# EAGLE design inst_amp (EAGLE 6.5.0)
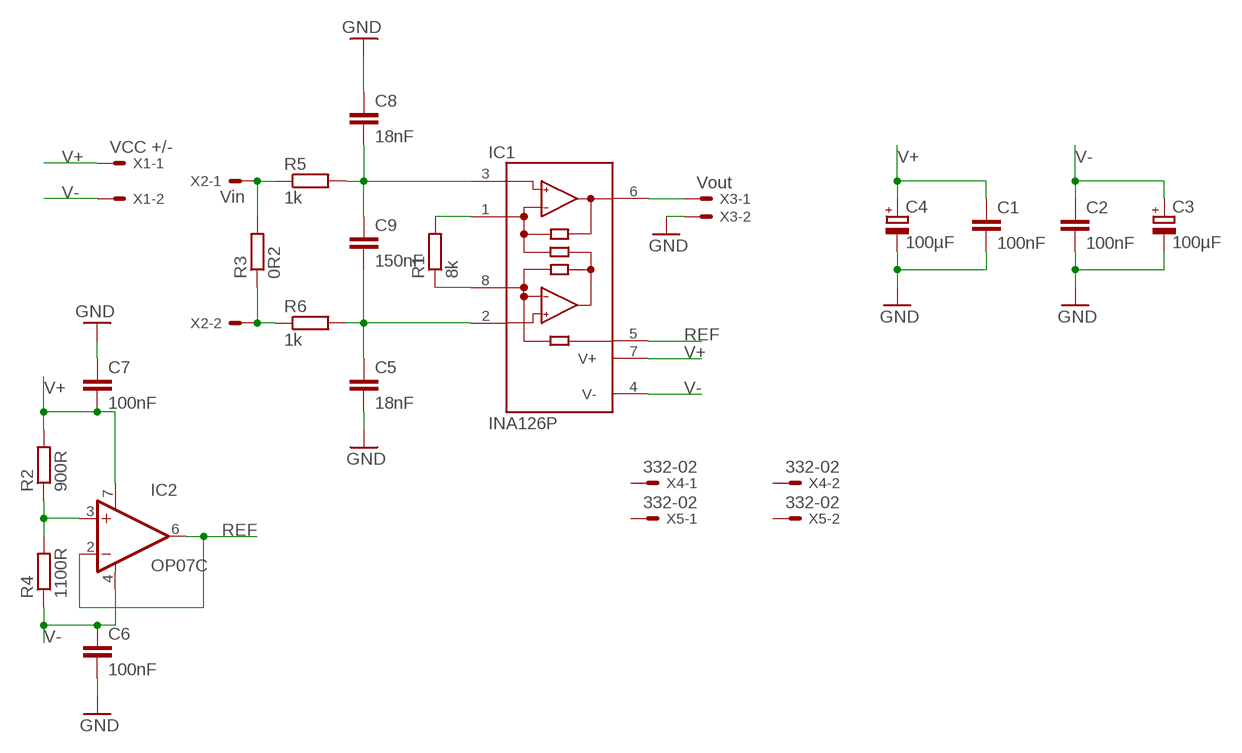
[diagram p0: schematic, sheet 1]

## Parts
C1  100nF  C-EU050-025X075  [C050-025X075]
C2  100nF  C-EU050-025X075  [C050-025X075]
C3  100µF  CPOL-EUE5-10.5  [E5-10,5]
C4  100µF  CPOL-EUE5-10.5  [E5-10,5]
C5  18nF  C-EU050-024X044  [C050-024X044]
C6  100nF  C-EU050-025X075  [C050-025X075]
C7  100nF  C-EU050-025X075  [C050-025X075]
C8  18nF  C-EU050-024X044  [C050-024X044]
C9  150nF  C-EU050-025X075  [C050-025X075]
IC1  INA126P  [DIL08]
IC2  OP07C  OPA658P  [DIL08]
R1  8k  R-EU_0207/10  [0207/10]
R2  900R  R-EU_0207/10  [0207/10]
R3  0R2  R-EU_0414/15  [0414/15]
R4  1100R  R-EU_0207/10  [0207/10]
R5  1k  R-EU_0207/10  [0207/10]
R6  1k  R-EU_0207/10  [0207/10]
X1  VCC +/-  22-23-2021  [22-23-2021]
X2  Vin  22-23-2021  [22-23-2021]
X3  Vout  22-23-2021  [22-23-2021]
X4  332-02  [332-02]
X5  332-02  [332-02]

## Nets
GND: C1.2 C2.2 C3.- C4.- C5.2 C6.2 C7.1 C8.1 X3.2
N$1: IC1.1(RG) R1.2
N$2: IC1.8(RG) R1.1
N$3: R3.1 R6.1 X2.2
N$4: IC2.3(+IN) R2.1 R4.2
N$5: IC1.6(OUT) X3.1
N$6: C8.2 C9.1 IC1.3(+IN) R5.2
N$7: C5.1 C9.2 IC1.2(-IN) R6.2
N$8: R3.2 R5.1 X2.1
REF: IC1.5(REF) IC2.2(-IN) IC2.6(OUT)
V+: C1.1 C4.+ C7.2 IC1.7(V+) IC2.7(V+) R2.2 X1.1
V-: C2.1 C3.+ C6.1 IC1.4(V-) IC2.4(V-) R4.1 X1.2
Unconnected: X4.1 X4.2 X5.1 X5.2

## Library data of the parts
C1 C2 C5-C9 = rcl:C-EU: CAPACITOR, European symbol
C3 C4 = rcl:CPOL-EU: POLARIZED CAPACITOR, European symbol
IC1 = burr-brown:INA126: Instrumentation Amplifier Micropower, Single and Dual Versions; MF: TEXAS INSTRUMENT CONNECTORS; MPN: INA126P; OC_FARNELL: 1509595; OC_NEWARK: 74C9780
IC2 = burr-brown:OPA658: Operational Amplifier Wideband, Low Power, Current Feedback; MPN: AD8001ANZ; OC_FARNELL: 9605304; OC_NEWARK: 19M0911
R1-R4 = rcl:R-EU_: RESISTOR, European symbol
R5 R6 = resistor:R-EU_: RESISTOR, European symbol
X1-X3 = con-molex:22-23-2021: .100" (2.54mm) Center Header - 2 Pin; MF: MOLEX; MPN: 22-23-2021; OC_FARNELL: 1462926; OC_NEWARK: 25C3832
X4 X5 = con-garry:332-02: 2 Pin - 2mm Dual Row Source: www.mpe-connector.de / garry_shortform_2012.pdf

## Board
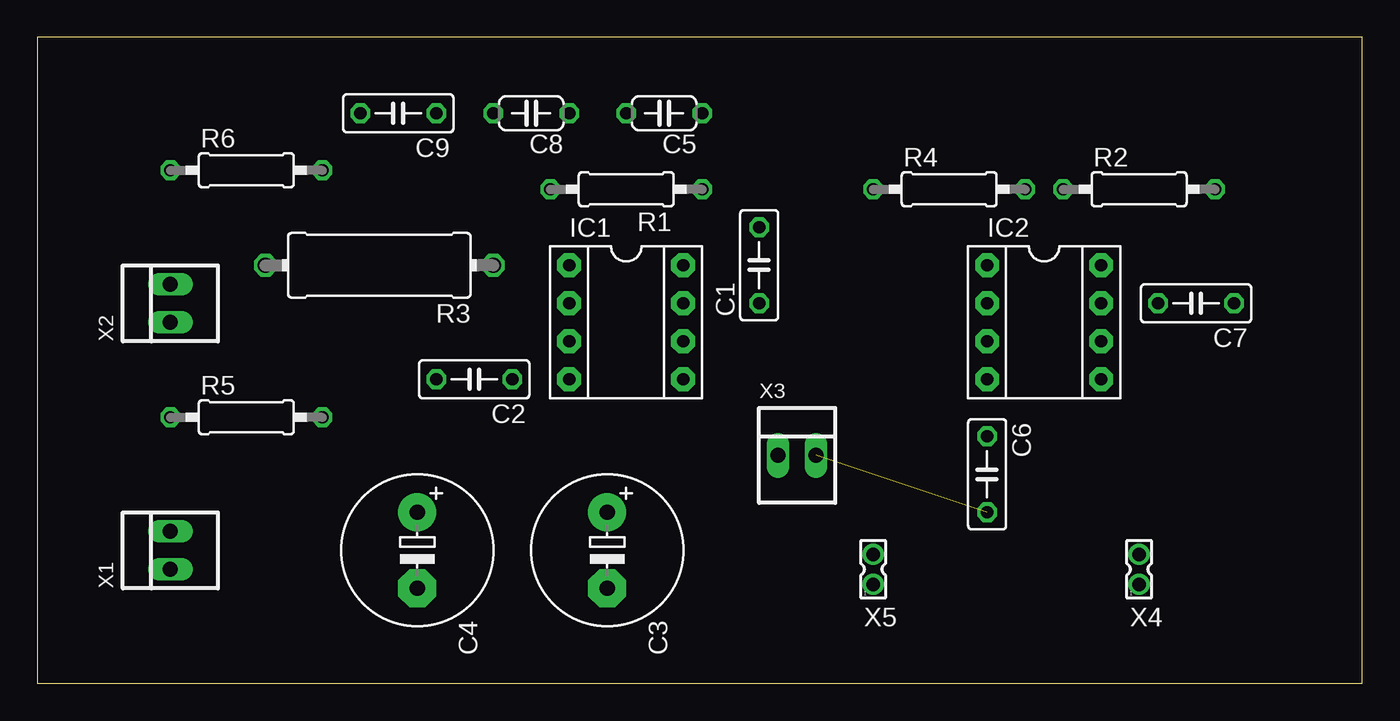
[diagram p1: board, top side]
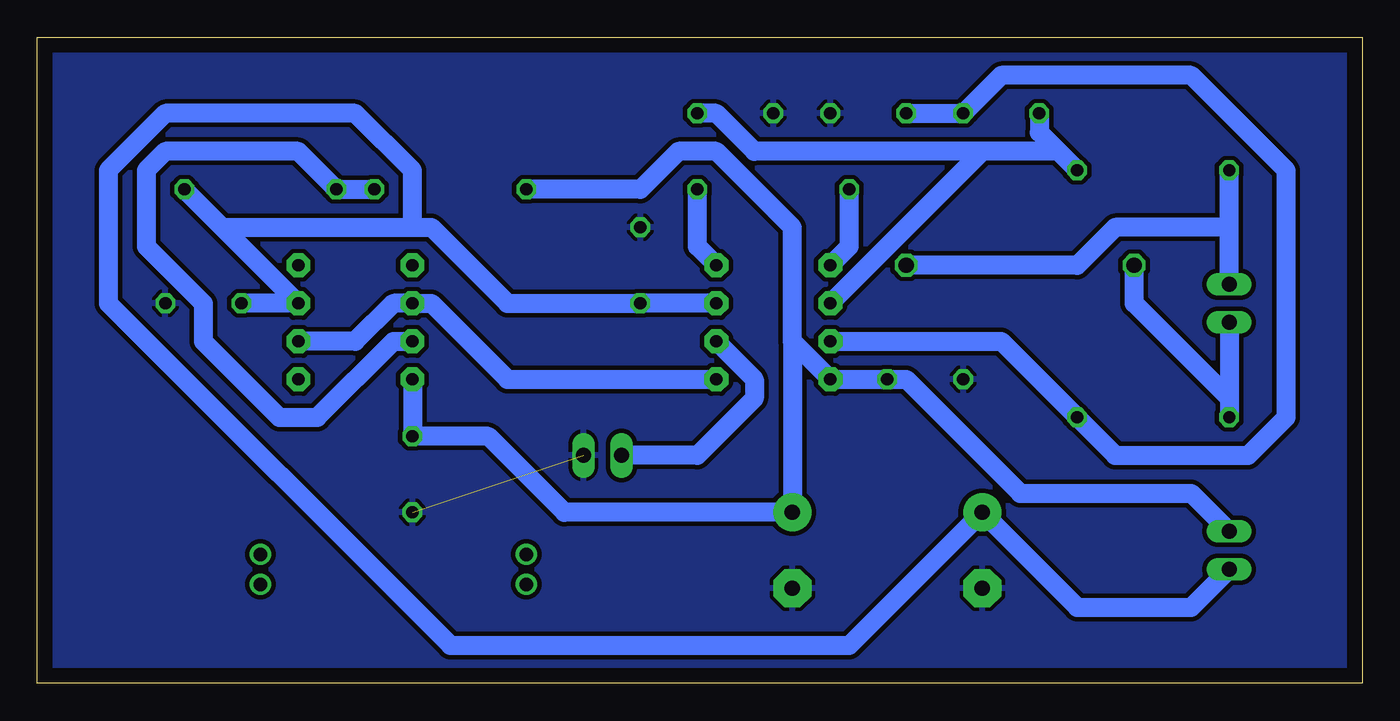
[diagram p2: board, bottom side, seen from below]

Size 88.57 x 43.17 mm. Coordinates in mm from the lower left corner, seen from the top.
Outline: 0,0 88.57,0 88.57,43.17 0,43.17 0,0
Copper layers (1*16): Top 0.035mm / dielectric 1.5mm / Bottom 0.035mm
Design rules "default *": minimum track width 50mil, minimum drill 24mil, track to track 12mil, track to pad 12mil, pad to pad 12mil, via to via 12mil, smd to smd 8mil, copper to edge 40mil, drill to drill 8mil, minimum pad ring 10mil, minimum via ring 8mil, stop-mask expansion 4mil, vias tented up to drill 0mil, thermal gap 10mil

### Footprints (pad centres in the part's own frame; a part is rotated, then mirrored left to right if it is on the bottom)
C050-025X075 = drill 0.813 octagon: 1 -2.54,0; 2 2.54,0
E5-10,5 = drill 1.016 pad 2.54: + -2.54,0 | drill 1.016 pad 2.54 octagon: - 2.54,0
C050-024X044 = drill 0.813 octagon: 1 -2.54,0; 2 2.54,0
DIL08 = drill 0.813 pad 1.6 octagon: 1 -3.81,-3.81; 2 -1.27,-3.81; 3 1.27,-3.81; 4 3.81,-3.81; 5 3.81,3.81; 6 1.27,3.81; 7 -1.27,3.81; 8 -3.81,3.81
0207/10 = drill 0.813 octagon: 1 -5.08,0; 2 5.08,0
0414/15 = drill 1.016 octagon: 1 -7.62,0; 2 7.62,0
22-23-2021 = drill 1 long: 1 -1.27,0; 2 1.27,0
332-02 = drill 0.9 pad 1.27: 1 0,-1; 2 0,1

### Placement (x,y rotation side)
C1  48.26,27.94 90 top
C2  29.21,20.32 180 top
C3  38.1,8.89 270 top
C4  25.4,8.89 270 top
C5  41.91,38.1 180 top
C6  63.5,13.97 270 top
C7  77.47,25.4 180 top
C8  33.02,38.1 180 top
C9  24.13,38.1 180 top
IC1  39.37,24.13 270 top
IC2  67.31,24.13 270 top
R1  39.37,33.02 180 top
R2  73.66,33.02 0 top
R3  22.86,27.94 180 top
R4  60.96,33.02 0 top
R5  13.97,17.78 0 top
R6  13.97,34.29 0 top
X1  8.89,8.89 90 top
X2  8.89,25.4 90 top
X3  50.8,15.24 0 top
X4  73.66,7.62 0 top
X5  55.88,7.62 0 top

### Tracks (layer width: path | path; a pad name or v marks a point on that pad's centre or on a via)
GND  (1 unrouted)
  pour Bottom: 0,43.18 0,0 88.9,0 88.9,43.18
N$1
  Bottom 1.27: R1.2 34.29,29.21 IC1.1
N$2
  Bottom 1.27: R1.1 44.45,29.21 IC1.8
N$3
  Bottom 1.27: X2.2 8.89,30.48 | 8.89,30.48 R6.1 | R3.1 19.05,27.94 16.51,30.48 8.89,30.48
N$4
  Bottom 1.27: R4.2 R2.1 71.12,35.56 80.01,35.56 81.28,34.29 81.28,29.21 77.47,25.4 77.47,22.86 72.39,17.78 69.85,17.78 64.77,22.86 IC2.3
N$5
  Bottom 1.27: X3.1 44.45,15.24 40.64,19.05 40.64,20.32 IC1.6
N$6
  Bottom 1.27: C8.2 C9.1 24.13,40.64 11.43,40.64 5.08,34.29 5.08,17.78 7.62,15.24 16.51,15.24 R5.2 24.13,22.86 IC1.3
N$7
  Bottom 1.27: 20.32,35.56 21.59,36.83 C9.2 | 20.32,35.56 R6.2 | C5.1 43.18,38.1 40.64,35.56 25.4,35.56 | 20.32,35.56 25.4,35.56 | 25.4,35.56 IC1.2
N$8
  Bottom 1.27: X2.1 8.89,19.05 | 8.89,19.05 R5.1 | R3.2 15.24,25.4 8.89,19.05
REF
  Bottom 1.27: IC1.5 57.15,20.32 62.23,25.4 IC2.2 64.77,25.4 67.31,22.86 IC2.6
V+
  Bottom 1.27: X1.1 11.43,5.08 19.05,5.08 C4.+ 34.29,2.54 60.96,2.54 83.82,25.4 83.82,34.29 80.01,38.1 67.31,38.1 63.5,34.29 63.5,30.48 | IC1.7 C1.1 57.15,25.4 62.23,30.48 63.5,30.48 | C7.2 IC2.7 76.2,30.48 | 76.2,30.48 R2.2 | 76.2,30.48 63.5,30.48
V-
  Bottom 1.27: IC2.4 C6.1 58.42,16.51 53.34,11.43 C3.+ 38.1,22.86 | R4.1 48.26,33.02 45.72,35.56 43.18,35.56 38.1,30.48 38.1,22.86 | 38.1,22.86 IC1.4 C2.1 30.48,20.32 22.86,12.7 11.43,12.7 X1.2